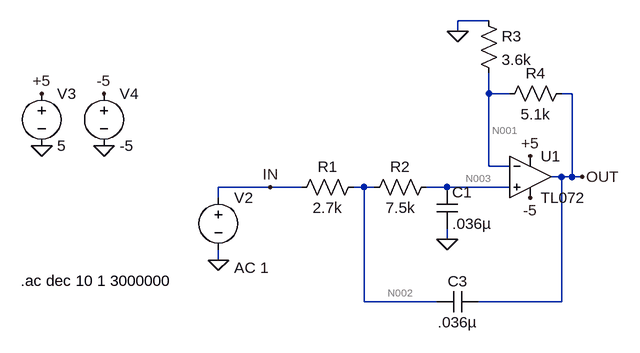
[diagram p0: schematic VCO_PWM_Sallen_Key.asc]
* VCO_PWM_Sallen_Key.asc
V2 IN 0 AC 1
R1 N002 IN 2.7k
R2 N003 N002 7.5k
C1 N003 0 .036µ
* U1: TL072 (symbol ZZZ\OpAmp\TL072 not available, pins judged from their places): In+=N003 In-=N001 V+=+5 V-=-5 OUT=OUT
C3 OUT N002 .036µ
V3 +5 0 5
V4 -5 0 -5
R4 OUT N001 5.1k
R3 0 N001 3.6k
.ac dec 10 1 3000000
.backanno
.end

* Results of the author's LTspice run, read from the files saved beside the schematic
* Operating Point, zero values left out:
*   V(n002) = 27 µV
*   V(n003) = 102 µV
*   V(out) = 195.5 µV
*   V(+5) = 5 V
*   V(-5) = -5 V
*   V(n001) = 102 µV
*   I(R4) = 18.33 nA
*   I(R3) = -28.33 nA
*   I(R2) = 10 nA
*   I(R1) = 10 nA
*   I(V4) = 341.3 µA
*   I(V3) = -341.4 µA
*   I(V2) = 10 nA
*   Ix(u1:2) = -10 nA
*   Ix(u1:1) = -10 nA
*   Ix(u1:4) = 341.4 µA
*   Ix(u1:5) = -341.3 µA
*   Ix(u1:3) = -18.33 nA
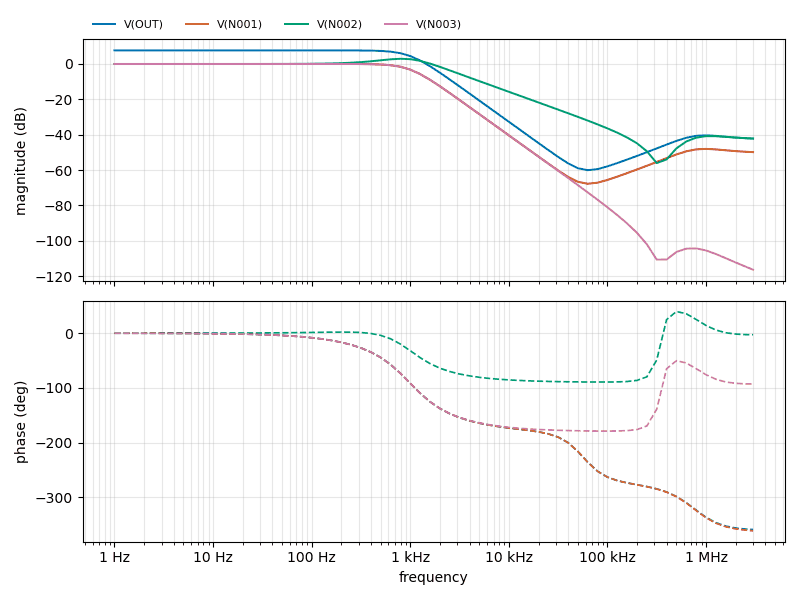
[diagram p1: AC Analysis of VCO_PWM_Sallen_Key.asc, plotted from the saved traces]
* AC Analysis, 1 run:
*   V(OUT): 7.66 dB at 1 Hz, -42.16 dB at 3 MHz, peak 7.66 dB at 1 Hz, 3 dB below the peak at 975.9 Hz
*   V(N001): -0.00 dB at 1 Hz, -49.84 dB at 3 MHz, peak -0.00 dB at 1 Hz, 3 dB below the peak at 975.9 Hz
*   V(N002): 0.00 dB at 1 Hz, -42.15 dB at 3 MHz, peak 2.94 dB at 794.3 Hz, 3 dB below the peak at 1.645 kHz
*   V(N003): -0.00 dB at 1 Hz, -116.29 dB at 3 MHz, peak -0.00 dB at 1 Hz, 3 dB below the peak at 975.9 Hz